# EAGLE design Board (EAGLE 8.7.0)
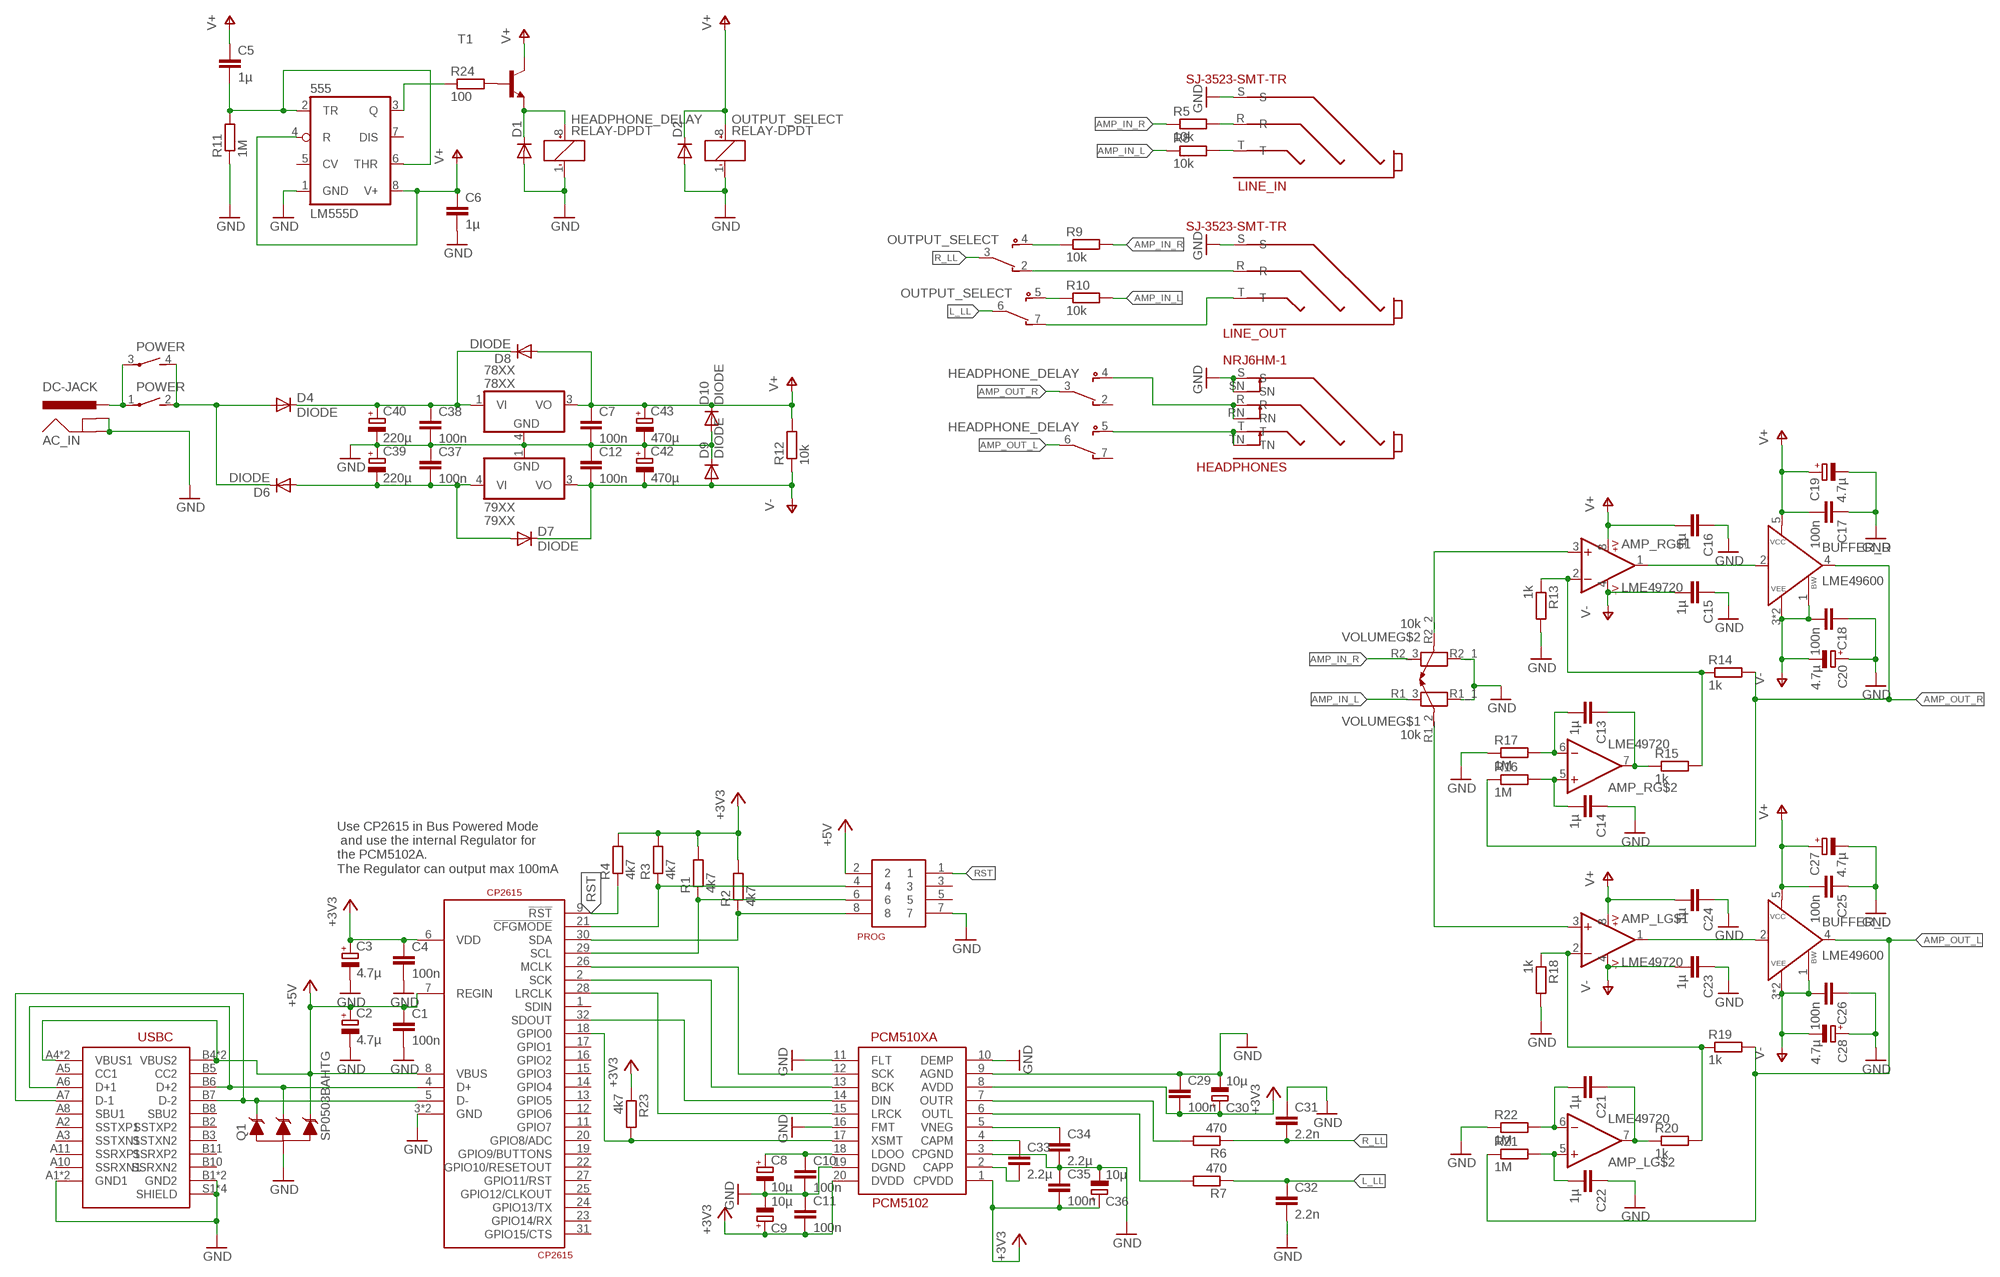
[diagram p0: schematic, sheet 1]

## Parts
78XX  78XX  [D2PAK]
79XX  79XX  [D2PAK]
555  LM555D  [SO08]
AC_IN  DC-JACK  [POWER_JACK_PTH]
AMP_L  LME49720  [SOIC127P600X175-8]
AMP_R  LME49720  [SOIC127P600X175-8]
BUFFER_L  LME49600  [TO170P1238X470-6]
BUFFER_R  LME49600  [TO170P1238X470-6]
C1  100n  C-EUC0603  [C0603]
C2  4.7µ  CPOL-EUUD-4X5,8  [UD-4X5,8_NICHICON]
C3  4.7µ  CPOL-EUUD-4X5,8  [UD-4X5,8_NICHICON]
C4  100n  C-EUC0603  [C0603]
C5  1µ  C-EUC0603  [C0603]
C6  1µ  C-EUC0603  [C0603]
C7  100n  C-EUC0603  [C0603]
C8  10µ  CPOL-EUUD-4X5,8  [UD-4X5,8_NICHICON]
C9  10µ  CPOL-EUUD-4X5,8  [UD-4X5,8_NICHICON]
C10  100n  C-EUC0603  [C0603]
C11  100n  C-EUC0603  [C0603]
C12  100n  C-EUC0603  [C0603]
C13  1µ  C-EUC0603  [C0603]
C14  1µ  C-EUC0603  [C0603]
C15  1µ  C-EUC0603  [C0603]
C16  1µ  C-EUC0603  [C0603]
C17  100n  C-EUC0603  [C0603]
C18  100n  C-EUC0603  [C0603]
C19  4.7µ  CPOL-EUSMCA  [SMC_A]
C20  4.7µ  CPOL-EUSMCA  [SMC_A]
C21  1µ  C-EUC0603  [C0603]
C22  1µ  C-EUC0603  [C0603]
C23  1µ  C-EUC0603  [C0603]
C24  1µ  C-EUC0603  [C0603]
C25  100n  C-EUC0603  [C0603]
C26  100n  C-EUC0603  [C0603]
C27  4.7µ  CPOL-EUSMCA  [SMC_A]
C28  4.7µ  CPOL-EUSMCA  [SMC_A]
C29  100n  C-EUC0603  [C0603]
C30  10µ  CPOL-EUUD-4X5,8  [UD-4X5,8_NICHICON]
C31  2.2n  C-EUC0603  [C0603]
C32  2.2n  C-EUC0603  [C0603]
C33  2.2µ  C-EUC0603  [C0603]
C34  2.2µ  C-EUC0603  [C0603]
C35  100n  C-EUC0603  [C0603]
C36  10µ  CPOL-EUUD-4X5,8  [UD-4X5,8_NICHICON]
C37  100n  C-EUC0603  [C0603]
C38  100n  C-EUC0603  [C0603]
C39  220µ  CPOL-EU175TMP-0810  [175TMP-0810]
C40  220µ  CPOL-EU175TMP-0810  [175TMP-0810]
C42  470µ  CPOL-EU175TMP-0810  [175TMP-0810]
C43  470µ  CPOL-EU175TMP-0810  [175TMP-0810]
CP2615  CP2615  [QFN50P500X500X90-32]
D1  DIODE-SOD323-W  [SOD323-W]
D2  DIODE-SOD323-W  [SOD323-W]
D4  DIODE  [SODFL5024X231]
D6  DIODE  [SODFL5024X231]
D7  DIODE  [SODFL5024X231]
D8  DIODE  [SODFL5024X231]
D9  DIODE  [SODFL5024X231]
D10  DIODE  [SODFL5024X231]
HEADPHONE_DELAY  RELAY-DPDT  [KEMET-UD2]
HEADPHONES  NRJ6HM-1  [NRJ6HM-1]
LINE_IN  SJ-3523-SMT-TR  [SJ-352X-SMT-TR]
LINE_OUT  SJ-3523-SMT-TR  [SJ-352X-SMT-TR]
OUTPUT_SELECT  RELAY-DPDT  [KEMET-UD2]
PCM5102  PCM510XA  [SOP65P640X120-20]
POWER  PB400  [PB400]
PROG  2X4_HEADER  [2X4_0.5_HEADER_SMD]
Q1  SP0503BAHTG  [SOT192P237X122-4]
R1  4k7  R-EU_R0603  [R0603]
R2  4k7  R-EU_R0603  [R0603]
R3  4k7  R-EU_R0603  [R0603]
R4  4k7  R-EU_R0603  [R0603]
R5  10k  R-EU_R0603  [R0603]
R6  470  R-EU_R0603  [R0603]
R7  470  R-EU_R0603  [R0603]
R8  10k  R-EU_R0603  [R0603]
R9  10k  R-EU_R0603  [R0603]
R10  10k  R-EU_R0603  [R0603]
R11  1M  R-EU_R0603  [R0603]
R12  10k  R-EU_R0603  [R0603]
R13  1k  R-EU_R0603  [R0603]
R14  1k  R-EU_R0603  [R0603]
R15  1k  R-EU_R0603  [R0603]
R16  1M  R-EU_R0603  [R0603]
R17  1M  R-EU_R0603  [R0603]
R18  1k  R-EU_R0603  [R0603]
R19  1k  R-EU_R0603  [R0603]
R20  1k  R-EU_R0603  [R0603]
R21  1M  R-EU_R0603  [R0603]
R22  1M  R-EU_R0603  [R0603]
R23  4k7  R-EU_R0603  [R0603]
R24  100  R-EU_R0603  [R0603]
T1  BC817-16-NPN-SOT23-BEC  [SOT23-BEC]
U$2  UJ31-CH-3-SMT-TR  [UJ31-CH-3-SMT-TR]
VOLUME  10k  ALPS-RK09L12B0  [ALPS-RK09L12B0]

## Nets
+3V3: C3.+ C4.1 C9.+ C11.2 C29.2 C30.+ C35.2 C36.+ CP2615.6(VDD) PCM5102.1(CPVDD) PCM5102.8(AVDD) PCM5102.20(DVDD) R1.2 R2.2 R3.2 R4.2 R23.1
+5V: C1.1 C2.+ CP2615.7(REGIN) CP2615.8(VBUS) PROG.2 Q1.4(C3) U$2.A4(VBUS1) U$2.A9(VBUS1) U$2.B4(VBUS2) U$2.B9(VBUS2)
AMP_IN_L: R8.1 R10.2 VOLUME.R1_3
AMP_IN_R: R5.1 R9.2 VOLUME.R2_3
AMP_OUT_L: BUFFER_L.4(OUT) HEADPHONE_DELAY.6(S2:W) R19.2 R21.1
AMP_OUT_R: BUFFER_R.4(OUT) HEADPHONE_DELAY.3(S1:W) R14.2 R16.1
GND: 78XX.4(GND) 79XX.1(GND) 555.1(GND) AC_IN.GND AC_IN.GNDBREAK C1.2 C2.- C3.- C4.2 C6.2 C7.2 C8.- C9.- C10.2 C11.1 C12.1 C14.1 C15.1 C16.1 C17.1 C18.1 C19.- C20.+ C22.1 C23.1 C24.1 C25.1 C26.1 C27.- C28.+ C29.1 C30.- C31.1 C32.2 C34.2 C35.1 C36.- C37.1 C38.2 C39.+ C40.- C42.+ C43.- CP2615.3(GND) CP2615.PAD(GND) D1.A D2.A D9.C D10.A HEADPHONE_DELAY.1(C:-) HEADPHONES.S HEADPHONES.SN LINE_IN.S LINE_OUT.S OUTPUT_SELECT.1(C:-) PCM5102.3(CPGND) PCM5102.9(AGND) PCM5102.10(DEMP) PCM5102.11(FLT) PCM5102.16(FMT) PCM5102.19(DGND) PROG.7 Q1.1(A) R11.1 R13.2 R17.1 R18.2 R22.1 U$2.A1(GND1) U$2.A12(GND1) U$2.B1(GND2) U$2.B12(GND2) U$2.S1(SHIELD) U$2.S2(SHIELD) U$2.S3(SHIELD) U$2.S4(SHIELD) VOLUME.R1_1 VOLUME.R2_1
L_LL: C32.1 OUTPUT_SELECT.6(S2:W) R7.1
N$1: CP2615.26(MCLK) PCM5102.12(SCK)
N$2: AMP_L.3(+IN) VOLUME.R1_2
N$3: C33.1 PCM5102.4(CAPM)
N$4: C33.2 PCM5102.2(CAPP)
N$5: CP2615.32(SDOUT) PCM5102.14(DIN)
N$6: CP2615.28(LRCLK) PCM5102.15(LRCK)
N$7: CP2615.2(SCK) PCM5102.13(BCK)
N$8: CP2615.21(!CFGMODE) PROG.4 R3.1
N$9: C8.+ C10.1 PCM5102.18(LDOO)
N$10: CP2615.5(D-) Q1.2(C1) U$2.A7(D-1) U$2.B7(D-2)
N$11: CP2615.4(D+) Q1.3(C2) U$2.A6(D+1) U$2.B6(D+2)
N$12: C34.1 PCM5102.5(VNEG)
N$13: CP2615.30(SDA) PROG.8 R2.1
N$14: LINE_OUT.R OUTPUT_SELECT.2(S1:NC)
N$15: CP2615.29(SCL) PROG.6 R1.1
N$16: AMP_L.2(-IN) R18.1 R19.1 R20.2
N$17: AMP_R.3(+IN) VOLUME.R2_2
N$18: AMP_R.2(-IN) R13.1 R14.1 R15.2
N$19: AMP_R.1(OUT) BUFFER_R.2(IN)
N$20: LINE_OUT.T OUTPUT_SELECT.7(S2:NC)
N$21: AMP_R.7(OUT) C13.1 R15.1
N$22: AMP_R.5(+IN) C14.2 R16.2
N$23: HEADPHONE_DELAY.5(S2:NO) HEADPHONES.T HEADPHONES.TN
N$24: AMP_R.6(-IN) C13.2 R17.2
N$25: AMP_L.1(OUT) BUFFER_L.2(IN)
N$26: AMP_L.7(OUT) C21.1 R20.1
N$27: AMP_L.5(+IN) C22.2 R21.2
N$28: HEADPHONE_DELAY.4(S1:NO) HEADPHONES.R HEADPHONES.RN
N$29: AMP_L.6(-IN) C21.2 R22.2
N$30: AC_IN.PWR POWER.1(P) POWER.3(P)
N$31: CP2615.18(GPIO0) PCM5102.17(XSMT) R23.2
N$32: LINE_IN.R R5.2
N$33: PCM5102.7(OUTR) R6.2
N$34: PCM5102.6(OUTL) R7.2
N$35: LINE_IN.T R8.2
N$36: OUTPUT_SELECT.5(S2:NO) R10.1
N$37: OUTPUT_SELECT.4(S1:NO) R9.1
N$38: D4.A D6.C POWER.2(S) POWER.4(S)
N$39: 555.2(TR) 555.6(THR) C5.2 R11.2
N$40: 79XX.4(VI) C37.2 C39.- D6.A D7.A
N$41: 78XX.1(VI) C38.1 C40.+ D4.C D8.C
N$42: 555.3(Q) R24.1
N$43: R24.2 T1.B
N$44: D1.C HEADPHONE_DELAY.8(C:+) T1.E
R_LL: C31.2 OUTPUT_SELECT.3(S1:W) R6.1
RST: CP2615.9(!RST) PROG.1 R4.1
V+: 78XX.3(VO) 555.4(R) 555.8(V+) AMP_L.8(+V) AMP_R.8(+V) BUFFER_L.5(VCC) BUFFER_R.5(VCC) C5.1 C6.1 C7.1 C16.2 C17.2 C19.+ C24.2 C25.2 C27.+ C43.+ D2.C D8.A D10.C OUTPUT_SELECT.8(C:+) R12.2 T1.C
V-: 79XX.3(VO) AMP_L.4(GND) AMP_R.4(GND) BUFFER_L.1(BW) BUFFER_L.3(VEE) BUFFER_L.6(VEE) BUFFER_R.1(BW) BUFFER_R.3(VEE) BUFFER_R.6(VEE) C12.2 C15.2 C18.2 C20.- C23.2 C26.2 C28.- C42.- D7.C D9.A R12.1
Unconnected: 555.5(CV) 555.7(DIS) CP2615.1(SDIN) CP2615.11(GPIO7) CP2615.12(GPIO6) CP2615.13(GPIO5) CP2615.14(GPIO4) CP2615.15(GPIO3) CP2615.16(GPIO2) CP2615.17(GPIO1) CP2615.19(GPIO9/BUTTONS) CP2615.20(GPIO8/ADC) CP2615.22(GPIO10/RESETOUT) CP2615.23(GPIO14/RX) CP2615.24(GPIO13/TX) CP2615.25(GPIO12/CLKOUT) CP2615.27(GPIO11/RST) CP2615.31(GPIO15/CTS) HEADPHONE_DELAY.2(S1:NC) HEADPHONE_DELAY.7(S2:NC) PROG.3 PROG.5 U$2.A2(SSTXP1) U$2.A3(SSTXN1) U$2.A5(CC1) U$2.A8(SBU1) U$2.A10(SSRXN1) U$2.A11(SSRXP1) U$2.B2(SSTXP2) U$2.B3(SSTXN2) U$2.B5(CC2) U$2.B8(SBU2) U$2.B10(SSRXN2) U$2.B11(SSRXP2)

## Notes on the sheet
- Use CP2615 in Bus Powered Mode
   and use the internal Regulator for 
  the PCM5102A.
  The Regulator can output max 100mA

## Library data of the parts
78XX = Parts:78XX
79XX = Parts:79XX
555 = linear:*555: TIMER
AC_IN = Parts:DC-JACK
AMP_L AMP_R = Parts:LME49720
BUFFER_L BUFFER_R = Parts:LME49600
C1 C4-C7 C10-C18 C21-C26 C29 C31-C35 C37 C38 = rcl:C-EU: CAPACITOR, European symbol; SPICEPREFIX: C
C2 C3 C8 C9 C19 C20 C27 C28 C30 C36 C39 C40 C42 C43 = rcl:CPOL-EU: POLARIZED CAPACITOR, European symbol; SPICEPREFIX: C
CP2615 = Parts:CP2615
D1 D2 = diode:DIODE-: DIODE
D4 D6-D10 = Parts:DIODE
HEADPHONE_DELAY OUTPUT_SELECT = Parts:RELAY-DPDT
HEADPHONES = Parts:NRJ6HM-1
LINE_IN LINE_OUT = Parts:SJ-3523-SMT-TR
PCM5102 = Parts:PCM510XA
POWER = Parts:PB400
PROG = Parts:2X4_HEADER
Q1 = Parts:SP0503BAHTG
R1-R24 = rcl:R-EU_: RESISTOR, European symbol; SPICEPREFIX: R
T1 = transistor:*-NPN-: NPN Transistror BF959 corrected 2008.03.06
U$2 = Parts:UJ31-CH-3-SMT-TR
VOLUME = Parts:ALPS-RK09L12B0

## Board
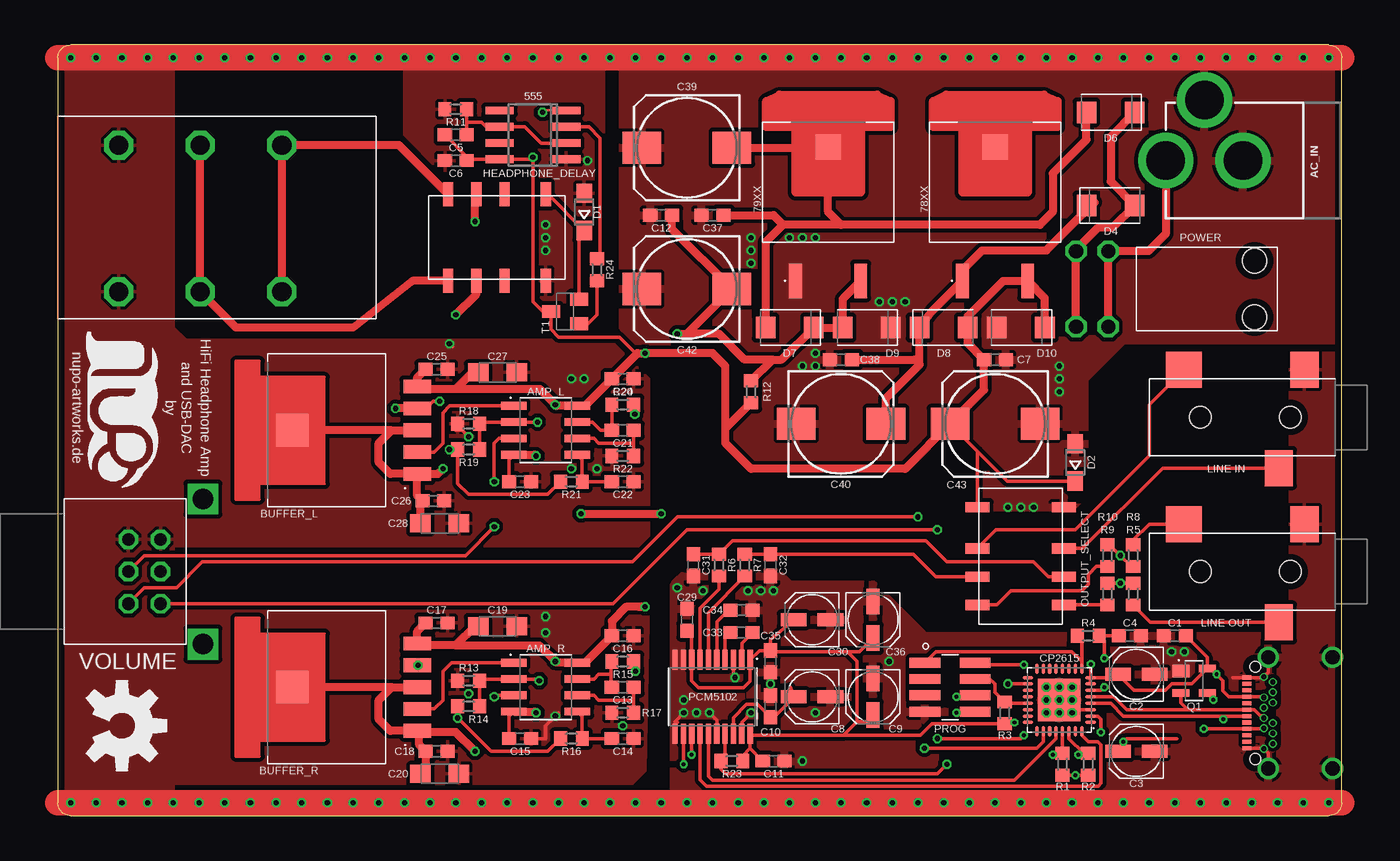
[diagram p1: board, top side]
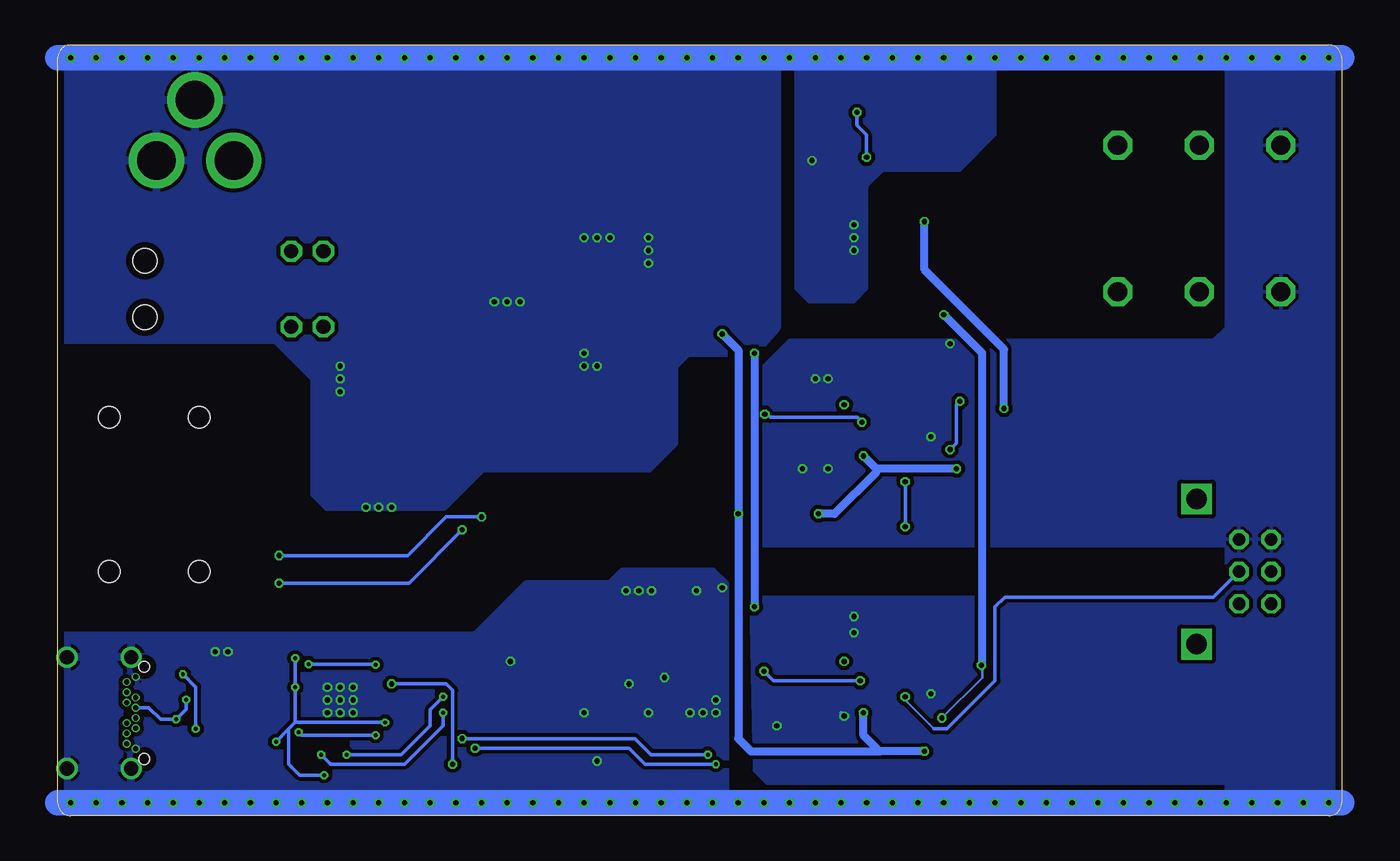
[diagram p2: board, bottom side, seen from below]

Size 100 x 60 mm. Coordinates in mm from the lower left corner, seen from the top.
Outline: 1,0 99,0 arc90 100,1 100,59 arc90 99,60 1,60 arc90 0,59 0,1 arc90 1,0
Copper layers (1*16): Top 0.035mm / dielectric 1.6mm / Bottom 0.035mm
Design rules "Elecrow_2-layer_PCB_eagle_rule *": minimum track width 6mil, minimum drill 12mil, track to track 6mil, track to pad 6mil, pad to pad 6mil, via to via 8mil, smd to smd 0mil, copper to edge 20mil, drill to drill 10mil, minimum pad ring 4mil, minimum via ring 6mil, stop-mask expansion 0mil, vias tented up to drill 100mil, thermal gap 10mil
tKeepout: 2 lines
bKeepout: 2 lines

### Footprints (pad centres in the part's own frame; a part is rotated, then mirrored left to right if it is on the bottom)
D2PAK = smd 2.678 x 0.998: 1 -6.368,2.54; 3 -6.368,-2.54 | smd 2 x 2: 4 4.047,0
SO08 = smd 0.6 x 2.2: 1 -1.905,-2.6; 2 -0.635,-2.6; 3 0.635,-2.6; 4 1.905,-2.6; 5 1.905,2.6; 6 0.635,2.6; 7 -0.635,2.6; 8 -1.905,2.6
POWER_JACK_PTH = drill 2.997 pad 4.318: GND 0,7.7; GNDBREAK 4.7,10.7; PWR 0,13.7
SOIC127P600X175-8 = smd 1.968 x 0.599: 1 -2.473,1.905; 2 -2.473,0.635; 3 -2.473,-0.635; 4 -2.473,-1.905; 5 2.473,-1.905; 6 2.473,-0.635; 7 2.473,0.635; 8 2.473,1.905
TO170P1238X470-6 = smd 2.16 x 1.07: 1 0,3.4; 2 0,1.7; 3 0,0; 4 0,-1.7; 5 0,-3.4 | smd 2.54 x 2.54: 6 9.72,0
C0603 = smd 1.1 x 1: 1 -0.85,0; 2 0.85,0
UD-4X5,8_NICHICON = smd 2 x 1: + 1.425,0; - -1.425,0
SMC_A = smd 1.6 x 1.4: + -1.5,0; - 1.5,0
175TMP-0810 = smd 3 x 2.5: + 3.5,0; - -3.5,0
QFN50P500X500X90-32 = smd 0.837 x 0.27: 1 -2.437,1.75; 2 -2.437,1.25; 3 -2.437,0.75; 4 -2.437,0.25; 5 -2.437,-0.25; 6 -2.437,-0.75; 7 -2.437,-1.25; 8 -2.437,-1.75; 17 2.437,-1.75; 18 2.437,-1.25; 19 2.437,-0.75; 20 2.437,-0.25; 21 2.437,0.25; 22 2.437,0.75; 23 2.437,1.25; 24 2.437,1.75 | smd 0.27 x 0.837: 9 -1.75,-2.437; 10 -1.25,-2.437; 11 -0.75,-2.437; 12 -0.25,-2.437; 13 0.25,-2.437; 14 0.75,-2.437; 15 1.25,-2.437; 16 1.75,-2.437; 25 1.75,2.437; 26 1.25,2.437; 27 0.75,2.437; 28 0.25,2.437; 29 -0.25,2.437; 30 -0.75,2.437; 31 -1.25,2.437; 32 -1.75,2.437 | smd 3.3 x 3.3: PAD 0,0
SOD323-W = smd 1.5 x 1.2: A 1.45,0; C -1.45,0
SODFL5024X231 = smd 1.52 x 1.68: A 1.88,0; C -1.88,0
KEMET-UD2 = smd 0.8 x 1.86: 1 0,3.37; 2 3.2,3.37; 3 5.4,3.37; 4 7.6,3.37; 5 7.6,-3.37; 6 5.4,-3.37; 7 3.2,-3.37; 8 0,-3.37
NRJ6HM-1 = drill 1.5 octagon: R -11.1,7.22; RN -11.1,-4.2; S -4.75,7.22; SN -4.75,-4.2; T -17.45,7.22; TN -17.45,-4.2
SJ-352X-SMT-TR = smd 2.2 x 2.8: R 4.4,3.95; S 2.4,-3.7 | smd 2.8 x 2.8: T 11.8,-3.7 | hole 1.7: 3.5,0; 10.5,0
SOP65P640X120-20 = smd 1.572 x 0.407: 1 -2.872,2.925; 2 -2.872,2.275; 3 -2.872,1.625; 4 -2.872,0.975; 5 -2.872,0.325; 6 -2.872,-0.325; 7 -2.872,-0.975; 8 -2.872,-1.625; 9 -2.872,-2.275; 10 -2.872,-2.925; 11 2.872,-2.925; 12 2.872,-2.275; 13 2.872,-1.625; 14 2.872,-0.975; 15 2.872,-0.325; 16 2.872,0.325; 17 2.872,0.975; 18 2.872,1.625; 19 2.872,2.275; 20 2.872,2.925
PB400 = drill 1.1 octagon: 1 13.19,2.95; 2 15.69,2.95; 3 13.19,-2.95; 4 15.69,-2.95 | hole 1.9: 1.79,2.2; 1.79,-2.2
2X4_0.5_HEADER_SMD = smd 0.76 x 2.4: 1 -1.905,-1.95; 2 -1.905,1.95; 3 -0.635,-1.95; 4 -0.635,1.95; 5 0.635,-1.95; 6 0.635,1.95; 7 1.905,-1.95; 8 1.905,1.95
SOT192P237X122-4 = smd 1.298 x 0.992: 1 -1.027,0.765 | smd 1.298 x 0.602: 2 -1.027,-0.96; 3 1.027,-0.96; 4 1.027,0.96
R0603 = smd 1 x 1.1: 1 -0.85,0; 2 0.85,0
SOT23-BEC = smd 1 x 1.4: B -0.95,-1.1; C 0,1.1; E 0.95,-1.1
UJ31-CH-3-SMT-TR = smd 0.32 x 0.7: A1 -2.75,8.38; A2 -2.25,8.38; A3 -1.75,8.38; A4 -1.25,8.38; A5 -0.75,8.38; A6 -0.25,8.38; A7 0.25,8.38; A8 0.75,8.38; A9 1.25,8.38; A10 1.75,8.38; A11 2.25,8.38; A12 2.75,8.38 | drill 0.4 pad 0.552: B1 2.8,7.07; B2 2.4,6.37; B3 1.6,6.37; B4 1.2,7.07; B5 0.8,6.37; B6 0.4,7.07; B7 -0.4,7.07; B8 -0.8,6.37; B9 -1.2,7.07; B10 -1.6,6.37; B11 -2.4,6.37; B12 -2.8,7.07 | drill 1.1: S1 -4.33,6.72; S2 4.33,6.72; S3 -4.33,1.72; S4 4.33,1.72 | hole 0.85: -3.6,7.72; 3.6,7.72
ALPS-RK09L12B0 = drill 1 octagon: R1_1 2.5,-2.5; R1_2 2.5,0; R1_3 2.5,2.5; R2_1 0,-2.5; R2_2 0,0; R2_3 0,2.5 | drill 1.6 square: S1 -3.3,5.65; S2 -3.3,-5.65

### Placement (x,y rotation side)
78XX  73,48 90 top
79XX  60,48 90 top
555  37,53 90 top
AC_IN  100,51 90 top
AMP_L  38,30 0 top
AMP_R  38,10 0 top
BUFFER_L  28,30 180 top
BUFFER_R  28,10 180 top
C1  87,14 180 top
C2  84,11 180 top
C3  84,5 180 top
C4  83.5,14 0 top
C5  31,53 0 top
C6  31,51 180 top
C7  73,35.5 0 top
C8  58.75,9.25 180 top
C9  63.5,9.25 270 top
C10  55.5,8.5 90 top
C11  55.75,4.25 180 top
C12  47,46.75 0 top
C13  44,10 0 top
C14  44,6 180 top
C15  36,6 180 top
C16  44,14 180 top
C17  29.5,15 180 top
C18  29.5,5 180 top
C19  34.25,14.75 0 top
C20  29.75,3.25 180 top
C21  44,30 0 top
C22  44,26 180 top
C23  36,26 180 top
C24  44,34 180 top
C25  29.5,34.75 180 top
C26  29.25,24.5 180 top
C27  34.25,34.5 0 top
C28  29.75,22.75 180 top
C29  49,15.25 270 top
C30  58.75,15.25 180 top
C31  49.5,19.5 90 top
C32  55.5,19.5 270 top
C33  53.25,14.25 0 top
C34  53.25,16 0 top
C35  55.5,12 90 top
C36  63.5,15.25 270 top
C37  51,46.75 0 top
C38  61,35.5 180 top
C39  49,52 180 top
C40  61,30.5 0 top
C42  49,41 180 top
C43  73,30.5 180 top
CP2615  78,9 180 top
D1  41,47 90 top
D2  79.25,27.5 90 top
D4  82,47.5 0 top
D6  82,54.75 180 top
D7  57,38 180 top
D8  69,38 0 top
D9  63,38 180 top
D10  75,38 180 top
HEADPHONE_DELAY  38,45 180 top
HEADPHONES  0,48 180 top
LINE_IN  99.5,19 180 top
LINE_OUT  99.5,31 180 top
OUTPUT_SELECT  75,24 270 top
PCM5102  51,9.25 270 top
POWER  95,41 180 top
PROG  69.5,10 270 top
Q1  88.5,10.5 0 top
R1  78.25,4 270 top
R2  80.25,4 270 top
R3  73.75,8 270 top
R4  80.25,14 0 top
R5  83.75,17.25 270 top
R6  51.5,19.5 270 top
R7  53.5,19.5 270 top
R8  83.75,20.25 90 top
R9  81.75,17.25 90 top
R10  81.75,20.25 90 top
R11  31,55 0 top
R12  54,33 270 top
R13  32,10.5 180 top
R14  32,8.5 180 top
R15  44,12 0 top
R16  40,6 0 top
R17  44,8 0 top
R18  32,30.5 180 top
R19  32,28.5 180 top
R20  44,32 0 top
R21  40,26 0 top
R22  44,28 0 top
R23  52.5,4.25 180 top
R24  42,42.5 270 top
T1  39.5,39.25 90 top
U$1  [LOGO-SILKSCREEN]  4,31.75 270 top
U$2  101,8 90 top
U$3  [OSHW-LOGO-L]  5,7 270 top
VOLUME  8,19 180 top

### Tracks (layer width: path | path; a pad name or v marks a point on that pad's centre or on a via)
+3V3  (via drill 0.3)
  Top 0.254: v81.5,12.25 81.5,13.6 R4.2 C4.1 | v81.5,10 81.25,9.75 CP2615.6 | R2.2 v79.25,3.15 R1.2 | v74.5,7.25 73.6,7.25 R3.2 | 54,6.25 53.92,6.17 | R3.2 73.35,6.75 | 61.17,6.25 67.17,6.25 68.08,7.15 R3.2 | C3.+ v83,5.75 83.25,6 87.15,6 | C35.2 54.65,12.85 PCM5102.1 53.92,10.47 53.42,9.97 49.91,9.97 49.38,10.5 PCM5102.8 49.38,14.03 C29.2 | 53.92,6.17 PCM5102.20 54.05,6.25 61.17,6.25 | 53.92,6.17 53.92,5.22 | 53.92,5.22 C11.2 | R23.1 53.35,4.65 53.92,5.22 | C35.2 55.6,12.75 61.5,12.75 | C30.+ 55.5,13.68 C35.2 | C36.+ 62.42,12.75 61.5,12.75 | 61.5,12.75 62.25,12 62.25,7.33 | 62.25,7.33 61.17,6.25 | C9.+ 63,7.33 62.25,7.33
  Bottom 0.254: v79.25,3.15 81.15,3.15 82,4 82,6.75 | 81.5,7.25 82,6.75 | 81.5,7.25 v74.5,7.25 | v81.5,12.25 v81.5,10 81.5,7.25 | v83,5.75 82,6.75
+5V  (via drill 0.3)
  Top 0.254: U$2.B4 93.88,9.25 U$2.A9 91.22,9.25 90.75,9.71 90.75,10.5 v90.25,11 89.79,11.46 Q1.4 | U$2.B9 93.88,6.75 U$2.A4 v89.25,6.75 | Q1.4 88.32,10.25 86.75,10.25 86.25,9.75 83.83,9.75 C2.+ 82.33,10.75 CP2615.8 | CP2615.7 CP2615.8 | 71.34,11.9 PROG.2 70.61,11.75 v75.25,11.75 | v80.45,11.79 80.45,10.77 CP2615.8 | C1.1 89.53,12.32 Q1.4
  Bottom 0.254: v89.25,6.75 89.25,10 v90.25,11 | v80.45,11.79 75.29,11.79 v75.25,11.75
AMP_IN_L  (via drill 0.4)
  Top 0.254: VOLUME.R1_3 6.75,17.75 9.25,17.75 11.25,19.75 44.75,19.75 48.25,23.25 v67,23.25 | 82.05,21.1 R10.2 | 81.85,21 R10.2 | R8.1 83.6,19.4 v82.75,20.25 81.9,21.1 R10.2
  Bottom 0.254: v67,23.25 69.75,23.25 72.75,20.25 v82.75,20.25
AMP_IN_R  (via drill 0.4)
  Top 0.254: VOLUME.R2_3 43.25,16.5 49,22.25 v68.5,22.25 | R5.1 v82.75,18.1 R9.2
  Bottom 0.254: v68.5,22.25 72.65,18.1 v82.75,18.1
AMP_OUT_L  (via drill 0.4)
  Top 0.254: R21.1 38.15,25 32,25 31.15,25.85 R19.2 v30.5,28.5 | BUFFER_L.4 28.15,31.85 | 28.15,31.85 28.3,32 | v29.75,32.25 29.25,32.25 28.85,31.85 28.15,31.85
  Top 0.61: BUFFER_L.4 v26.3,31.7 | v32.5,46.25 32.5,48.27 HEADPHONE_DELAY.6
  Bottom 0.254: v29.75,32.25 30,32 30,29 v30.5,28.5
  Bottom 0.61: v26.3,31.7 26.3,36.3 32.5,42.5 v32.5,46.25
AMP_OUT_R  (via drill 0.4)
  Top 0.254: R14.2 v31.15,7.6 33.75,5 38.15,5 R16.1
  Top 0.61: BUFFER_R.4 v28.05,11.7 | v31,39 32.6,40.6 HEADPHONE_DELAY.3
  Bottom 0.203: v31.15,7.6 28,10.75 28,11.75
  Bottom 0.254: v31.15,7.6 31.1,7.85 30.95,7.7
  Bottom 0.61: v28.05,11.7 28,11.75 28,36 v31,39
GND  (via drill 0.4)
  Top 0.254: CP2615.3 78.25,8.25 v78,8 CP2615.PAD | 48.25,7.25 48.08,7.08 PCM5102.11 48.08,7.33 v48.75,8 | 51.25,5.95 PCM5102.16 51.33,7.42 v50.75,8 | 53.27,7.03 PCM5102.19 53.27,7.28 v54,8 | R11.1 30,55 | 30,51 C6.2 | 555.1 39.7,51 | 31.15,10.35 R13.2 | C15.1 38,6 38,7 v38.75,7.75 39,8 | R18.2 31,30.35 31,30 31.5,30 v32,29.5 | 30.75,36.5 v30.5,36.75 | U$2.A1 93.88,5.25 U$2.B12 94.28,4.85 U$2.S1 | U$2.S2 94.28,11.15 U$2.B1 93.88,10.75 U$2.A12 91.5,10.75 | PCM5102.3 52.62,10.88 v52.75,10.75
  Top 2: 0,59 v1,59 v3,59 v5,59 v7,59 v9,59 v11,59 v13,59 v15,59 v17,59 v19,59 v21,59 v23,59 v25,59 v27,59 v29,59 v31,59 v33,59 v35,59 v37,59 v39,59 v41,59 v43,59 v45,59 v47,59 v49,59 v51,59 v53,59 v55,59 v57,59 v59,59 v61,59 v63,59 v65,59 v67,59 v69,59 v71,59 v73,59 v75,59 v77,59 v79,59 v81,59 v83,59 v85,59 v87,59 v89,59 v91,59 v93,59 v95,59 v97,59 v99,59 100,59 | 0,1 v1,1 v3,1 v5,1 v7,1 v9,1 v11,1 v13,1 v15,1 v17,1 v19,1 v21,1 v23,1 v25,1 v27,1 v29,1 v31,1 v33,1 v35,1 v37,1 v39,1 v41,1 v43,1 v45,1 v47,1 v49,1 v51,1 v53,1 v55,1 v57,1 v59,1 v61,1 v63,1 v65,1 v67,1 v69,1 v71,1 v73,1 v75,1 v77,1 v79,1 v81,1 v83,1 v85,1 v87,1 v89,1 v91,1 v93,1 v95,1 v97,1 v99,1 100,1
  Bottom 0.254: v38.75,7.75 39,8
  Bottom 2: 0,59 v1,59 v3,59 v5,59 v7,59 v9,59 v11,59 v13,59 v15,59 v17,59 v19,59 v21,59 v23,59 v25,59 v27,59 v29,59 v31,59 v33,59 v35,59 v37,59 v39,59 v41,59 v43,59 v45,59 v47,59 v49,59 v51,59 v53,59 v55,59 v57,59 v59,59 v61,59 v63,59 v65,59 v67,59 v69,59 v71,59 v73,59 v75,59 v77,59 v79,59 v81,59 v83,59 v85,59 v87,59 v89,59 v91,59 v93,59 v95,59 v97,59 v99,59 100,59 | 100,1 v99,1 v97,1 v95,1 v93,1 v91,1 v89,1 v87,1 v85,1 v83,1 v81,1 v79,1 v77,1 v75,1 v73,1 v71,1 v69,1 v67,1 v65,1 v63,1 v61,1 v59,1 v57,1 v55,1 v53,1 v51,1 v49,1 v47,1 v45,1 v43,1 v41,1 v39,1 v37,1 v35,1 v33,1 v31,1 v29,1 v27,1 v25,1 v23,1 v21,1 v19,1 v17,1 v15,1 v13,1 v11,1 v9,1 v7,1 v5,1 v3,1 v1,1 0,1
  other vias: 78,9 77,10 78,10 79,10 77,9 79,9 77,8 79,8 49.75,8 41.25,51 32,9.5 55.5,10.25 40,27 54,45 54,43 54,44 57,45 58,45 59,45 44,7 58,35 59,35 59,36 64,40 65,40 66,40 53.75,17.5 54.75,17.5 55.75,17.5 64.75,12 41,34 40,34 48.75,9 58,4.25 38,14.25 38,15.5 42,27 59,8 86.75,12.75 87.75,12.75 75,24 78,33 78,34 78,35 50.25,17.5 48.25,17.75 38,46 38,45 38,44 74,24 76,24
  pour Bottom (isolate 0.305): 99,60 44,60 44,38 45.75,36 51,36 52,35 52,29 54,27 67,27 70,24 79,24 80,25 80,34 83,37 100,37 100,59
  pour Top (isolate 0.305): 99,60 44,60 44,38 45.75,36 51,36 52,35 52,29 54,27 67,27 70,24 79,24 80,25 80,34 83,37 100,37 100,59
  pour Bottom (isolate 0.305): 100,1 99,0 48,0 48,18 49,19 56,19 57,18 63.5,18 67.5,14 100,14
  pour Top (isolate 0.305): 100,1 99,0 48,0 48,18 49,19 56,19 57,18 63.5,18 67.5,14 100,14
  pour Top (isolate 0.305): 9,0 9,2.5 44.75,2.5 45.75,3.5 46,17 0,17 0,1 1,0
  pour Top (isolate 0.305): 0,37 0,17 9,17 9,21 46,21 46,34 43,37
  pour Bottom (isolate 0.305): 0,37 0,17 9,17 9,21 46,21 46,34 43,37
  pour Bottom (isolate 0.305): 9,0 9,2.5 44.75,2.5 45.75,3.5 46,17 0,17 0,0
  pour Bottom (isolate 0.305): 0,59 9,59 9,38 10,37 0,37
  pour Top (isolate 0.305): 0,59 9,59 9,38 10,37 0,37
  pour Top (isolate 0.305): 96,36 96,14 100,14 100,36
  pour Bottom (isolate 0.305): 27,59 27,53 29.75,50.25 35.75,50.25 37,49 37,41 38,40 41.5,40 42.5,41 42.5,59
  pour Top (isolate 0.305): 27,59 27,53 29.75,50.25 35.75,50.25 37,49 37,41 38,40 41.5,40 42.5,41 42.5,59
L_LL
  Top 0.254: C32.1 55.4,20.25 | C32.1 R7.1 | C32.1 66.65,20.35 68.4,18.6 OUTPUT_SELECT.6
N$1  (via drill 0.3, 0.4)
  Top 0.254: CP2615.26 76.75,5.75 76.25,5.25 v67.5,5.25 | 48.75,5.9 PCM5102.12 48.73,4.03 v48.75,4
  Bottom 0.254: v48.75,4 54.25,4 55.5,5.25 v67.5,5.25
N$2  (via drill 0.4)
  Top 0.254: AMP_L.3 34.37,29.36 34,29 v34,26 | VOLUME.R1_2 6.75,20.25 31.75,20.25 v34,22.5
  Bottom 0.254: v34,26 v34,22.5
N$3
  Top 0.254: PCM5102.4 51.98,13.85 52.4,14.28 C33.1
N$4
  Top 0.254: PCM5102.2 53.27,13.43 C33.2
N$5
  Top 0.254: CP2615.32 79.75,6.25 80.25,5.75 81,5.75 81.25,5.5 81.25,2.5 81.03,2.28 50.52,2.28 50.02,2.77 PCM5102.14
N$6
  Top 0.254: CP2615.28 77.75,6 74.5,2.75 51,2.75 50.67,3.08 PCM5102.15
N$7  (via drill 0.3, 0.4)
  Top 0.254: v75.25,6.25 75,6 v68.5,6 | v81.25,6.5 81.25,7.5 81,7.75 CP2615.2 | PCM5102.13 49.38,4.87 v49.37,4.75
  Bottom 0.254: v75.25,6.25 81,6.25 v81.25,6.5 | v49.37,4.75 53.79,4.75 55.04,6 v68.5,6
N$8
  Top 0.254: CP2615.21 73.9,8.75 R3.1 73,9.6 73,10.25 72.61,10.63 PROG.4
N$9
  Top 0.254: PCM5102.18 52.62,7.62 53.65,8.65 54.5,8.65 C10.1 55.77,7.65 57.06,8.94 57.06,9.99 C8.+
N$10
  Top 0.254: 92.28,8.25 U$2.A7 | CP2615.5 82.25,9.25 83.25,8.25 88,8.25 | 88,8.25 U$2.A7 | Q1.2 87.47,8.78 88,8.25 | U$2.B7 93.76,7.77 93.67,7.77 93.19,8.25 U$2.A7
N$11  (via drill 0.3)
  Top 0.254: CP2615.4 82,8.75 83,7.75 U$2.A6 91.04,7.75 v90.79,7.5 | Q1.3 90,9.07 v90,9.03
  Bottom 0.254: U$2.B6 92.9,8.4 92,7.5 v90.79,7.5 90,8.29 v90,9.03
N$12
  Top 0.254: PCM5102.5 51.33,15.07 52.25,16 C34.1
N$13  (via drill 0.3)
  Top 0.254: CP2615.30 78.75,6 79.9,4.85 R2.1 79.6,4.85 v79.5,4.75 | 71.66,8.1 PROG.8 70.34,8.1 v70,8
  Bottom 0.254: v70,8 70,7 73,4 78.75,4 v79.5,4.75
N$14
  Top 0.254: LINE_OUT.R 86.05,27.05 79.8,20.8 OUTPUT_SELECT.2
N$15  (via drill 0.3)
  Top 0.254: CP2615.29 R1.1 78.15,4.75 v77.5,4.75 | 71.89,9.37 PROG.6 70.36,9.37 v70,9.25
  Bottom 0.254: v77.5,4.75 73.25,4.75 71,7 71,8.25 v70,9.25
N$16  (via drill 0.4)
  Top 0.254: R19.1 R18.1 33.22,30.64 AMP_L.2 v37.37,30.64 | v44.94,31.25 44.94,31.91 R20.2
  Bottom 0.254: v37.37,30.64 37.73,31 44.5,31 44.75,31.25 v44.94,31.25
N$17  (via drill 0.4)
  Top 0.254: AMP_R.3 34.37,9.37 34,9 v34,9.25
  Bottom 0.203: 31.75,6.75 34,9 v34,9.25
  Bottom 0.254: VOLUME.R2_2 10,17 26.25,17 27,16.25 27,10.5 30.75,6.75 31.75,6.75
N$18  (via drill 0.4)
  Top 0.254: R14.1 R13.1 33.22,10.63 AMP_R.2 37.37,10.63 v37.5,10.5 | v45,11.25 R15.2
  Bottom 0.254: v37.5,10.5 44.25,10.5 v45,11.25
N$19
  Top 0.254: AMP_R.1 30.66,11.9 30,11.25 30,9 29.3,8.3 BUFFER_R.2
N$20
  Top 0.254: LINE_OUT.T 85,32 85,28 79.25,22.25 73.08,22.25 OUTPUT_SELECT.7
N$21
  Top 0.254: C13.1 43.08,10.07 43.08,11 | R15.1 43.08,11.93 43.08,11 | AMP_R.7 41.76,10.63 42.12,11 43.08,11
N$22
  Top 0.254: C14.2 R16.2 40.85,7.72 AMP_R.5
N$23
  Top 0.61: HEADPHONE_DELAY.5 26.57,52.2 HEADPHONES.TN HEADPHONES.T
N$24
  Top 0.254: C13.2 44.85,9 | 44.85,9 R17.2 | 44.85,9 42.12,9 41.75,9.38 40.48,9.38 AMP_R.6
N$25
  Top 0.254: BUFFER_L.2 29.3,28.3 30,29 30,31.38 30.53,31.91 AMP_L.1
N$26
  Top 0.254: 43.15,30.15 C21.1 | AMP_L.7 41.63,30.64 42.27,30 C21.1 | 43.15,30.3 C21.1 | C21.1 R20.1
N$27
  Top 0.254: AMP_L.5 40.85,27.72 R21.2 C22.2
N$28
  Top 0.61: HEADPHONE_DELAY.4 27.63,41.63 23,38 13.88,38 HEADPHONES.R HEADPHONES.RN
N$29
  Top 0.254: R22.2 44.85,29 | 44.85,29 C21.2 | 44.85,29 42.12,29 41.75,29.38 40.48,29.38 AMP_L.6
N$30
  Top 0.61: AC_IN.PWR 86.3,45.3 84.95,43.95 POWER.3 POWER.1
N$31  (via drill 0.4)
  Top 0.254: PCM5102.17 51.98,4.58 R23.2 51.65,3.6 52,3.25 68.5,3.25 v69.25,4 | CP2615.18 v74,10.25
  Bottom 0.254: v69.25,4 69.25,9.75 69.75,10.25 v74,10.25
N$32
  Top 0.254: LINE_IN.R 85.1,15.05 R5.2
N$33
  Top 0.254: PCM5102.7 50.02,16.15 51.5,17.62 R6.2
N$34
  Top 0.254: PCM5102.6 50.67,15.8 53.5,18.62 R7.2
N$35
  Top 0.254: LINE_IN.T 85,22.7 83.75,21.45 R8.2
N$36
  Top 0.254: OUTPUT_SELECT.5 73.15,16.4 74.25,17.5 79.75,17.5 80.25,18 80.25,18.75 80.9,19.4 R10.1
N$37
  Top 0.254: OUTPUT_SELECT.4 R9.1
N$38
  Top 0.61: POWER.2 POWER.4 79.31,44.06 81,45.75 82.13,45.75 D4.A 82,49.38 82,52.87 D6.C
N$39
  Top 0.254: 555.2 37.63,52.37 36.37,53.63 555.6 33.37,53.63 33,54 31.85,54 | R11.2 31.85,54 | 31.85,54 C5.2
N$40
  Top 0.61: 60,51 60,47 61,46 | 60,51 79XX.4 60,53 | 61,46 76.5,46 77.5,47 77.5,50 80.12,52.62 D6.A | C39.- 59.25,52 60,51 | D7.A 55.12,44.62 56.5,46 | 61,46 56.5,46 | C37.2 55.75,46.75 56.5,46
N$41
  Top 0.61: 67.12,35.12 D8.C 68.12,39.29 78XX.1 70.46,42.46 72,44 77,44 80.12,47.12 D4.C 80.75,47.75 | C40.+ 64.5,32.5 67.12,35.12 | 67.12,35.12 66.74,35.5 C38.1
N$42
  Top 0.254: 555.3 41.37,53.63 42.25,52.75 42.25,43.6 R24.1
N$43
  Top 0.254: 41.95,41.95 R24.2 | 41.95,41.6 R24.2 | R24.2 42,39 41,38 40.7,38.3 T1.B
N$44
  Top 0.254: T1.E 40.6,45.15 D1.C 38.18,48.37 HEADPHONE_DELAY.8
R_LL
  Top 0.254: C31.2 R6.1 52.55,21.4 67.6,21.4 69.25,19.75 76,19.75 77.15,18.6 OUTPUT_SELECT.3
RST
  Top 0.254: CP2615.9 79.75,12 | 79.75,12 79.75,13.5 79.4,13.85 R4.1 | PROG.1 68.39,12.75 79,12.75 79.75,12
V+  (via drill 0.4)
  Top 0.203: 555.4 37.91,54.91 v37.75,54.75
  Top 0.254: 28.15,33.55 BUFFER_L.5 28.2,33.2 28.4,33 | C5.1 31.85,51.3 C6.1 31.95,51.09 555.8 36.84,51.09 v37,51.25 37,40 37.75,39.25 T1.C 38.4,37.85 39,37.25 43.75,37.25 45.08,35.92 | 32.12,33.33 32,33.2 | 45.1,36 45.15,36 | D2.C 73.95,26.05 71.63,28.37 | C43.+ 71,29 71.63,28.37 | OUTPUT_SELECT.8 71.63,28.37
  Top 0.61: D10.C 76.88,40.29 78XX.3 73.63,41.63 70.88,38.88 D8.A 70.88,36.77 C7.1 72.15,33.15 C43.+ 66,27 54,27 52,29 52,30.15 | 52,30.15 52,35 51,36 v45.75,36 45.15,36 45.08,35.92 C24.2 41.05,31.91 AMP_L.8 38.84,31.91 v38.75,32 37.55,33.2 32,33.2 31,33.2 | R12.2 52,30.15 | 31,33.2 28.2,33.2 | BUFFER_R.5 27.35,13.4 27.25,13.5 | 45.25,16.25 v45.75,16.25 44.25,16.25 43.15,15.15 C16.2 41.05,11.9 AMP_R.8 38.84,11.9 v38.75,12 37.5,13.25 31,13.25 | C19.+ 32.5,14.75 31,13.25 | 31,13.25 28.15,13.25 BUFFER_R.5 | C27.+ 32.3,34.5 31,33.2 | BUFFER_R.5 28,14.35 C17.2 | BUFFER_L.5 28,34.1 C25.2
  Bottom 0.254: v37.75,54.75 37.75,53.75 37,53 v37,51.25
  Bottom 0.61: v45.75,36 v45.75,16.25
V-  (via drill 0.4)
  Top 0.254: C23.2 35.15,27.72 AMP_L.4 | C15.2 35.15,7.72 AMP_R.4 | 28.15,26.45 BUFFER_L.1
  Top 0.61: 26,30 25,29 25,27.5 25.9,26.6 BUFFER_L.1 | 26,10 25,9 25,7.5 25.9,6.6 27.75,6.6 | 27.75,6.6 BUFFER_R.1 28.15,6.45 28.15,5.5 C18.2 28.65,3.65 C20.- | 26,10 BUFFER_R.6 17,12 | 26,30 BUFFER_L.6 | 26,10 BUFFER_R.3 | 26,30 BUFFER_L.3 | 79XX.3 61.12,40.21 D9.A D7.C 56.38,35.5 55.65,35.5 | AMP_L.4 37.16,28.09 v37.25,28 | AMP_R.4 37.16,8.1 v37.25,8 | 49,37.5 C42.- 47.85,45.65 C12.2 | v48.25,37.5 49,37.5 | 55.65,35.5 53.5,35.5 51.5,37.5 49,37.5 | R12.1 55.65,35.5 | v30,27 29.6,26.6 BUFFER_L.1 | v40.75,23.5 v47,23.5 | v32.5,5 31,6.5 27.85,6.5 27.75,6.6 | BUFFER_L.1 28,24.9 C26.2 28.25,24.35 C28.-
  Bottom 0.61: 36.25,27 v37.25,28 | v30,27 36.25,27 | v32.5,5 36,5 | v37.25,8 37.25,6.25 36,5 | v48.25,37.5 47,36.25 v47,23.5 47,6 46,5 36,5 | 36.25,27 36.25,26.75 39.5,23.5 v40.75,23.5

### Text on the board
tPlace: nupo-artworks.de | by | and USB-DAC | HiFi Headphone Amp
tNames: LINE IN | LINE OUT